# EAGLE schematic MCU board v1.2 (EAGLE 9.1.3)
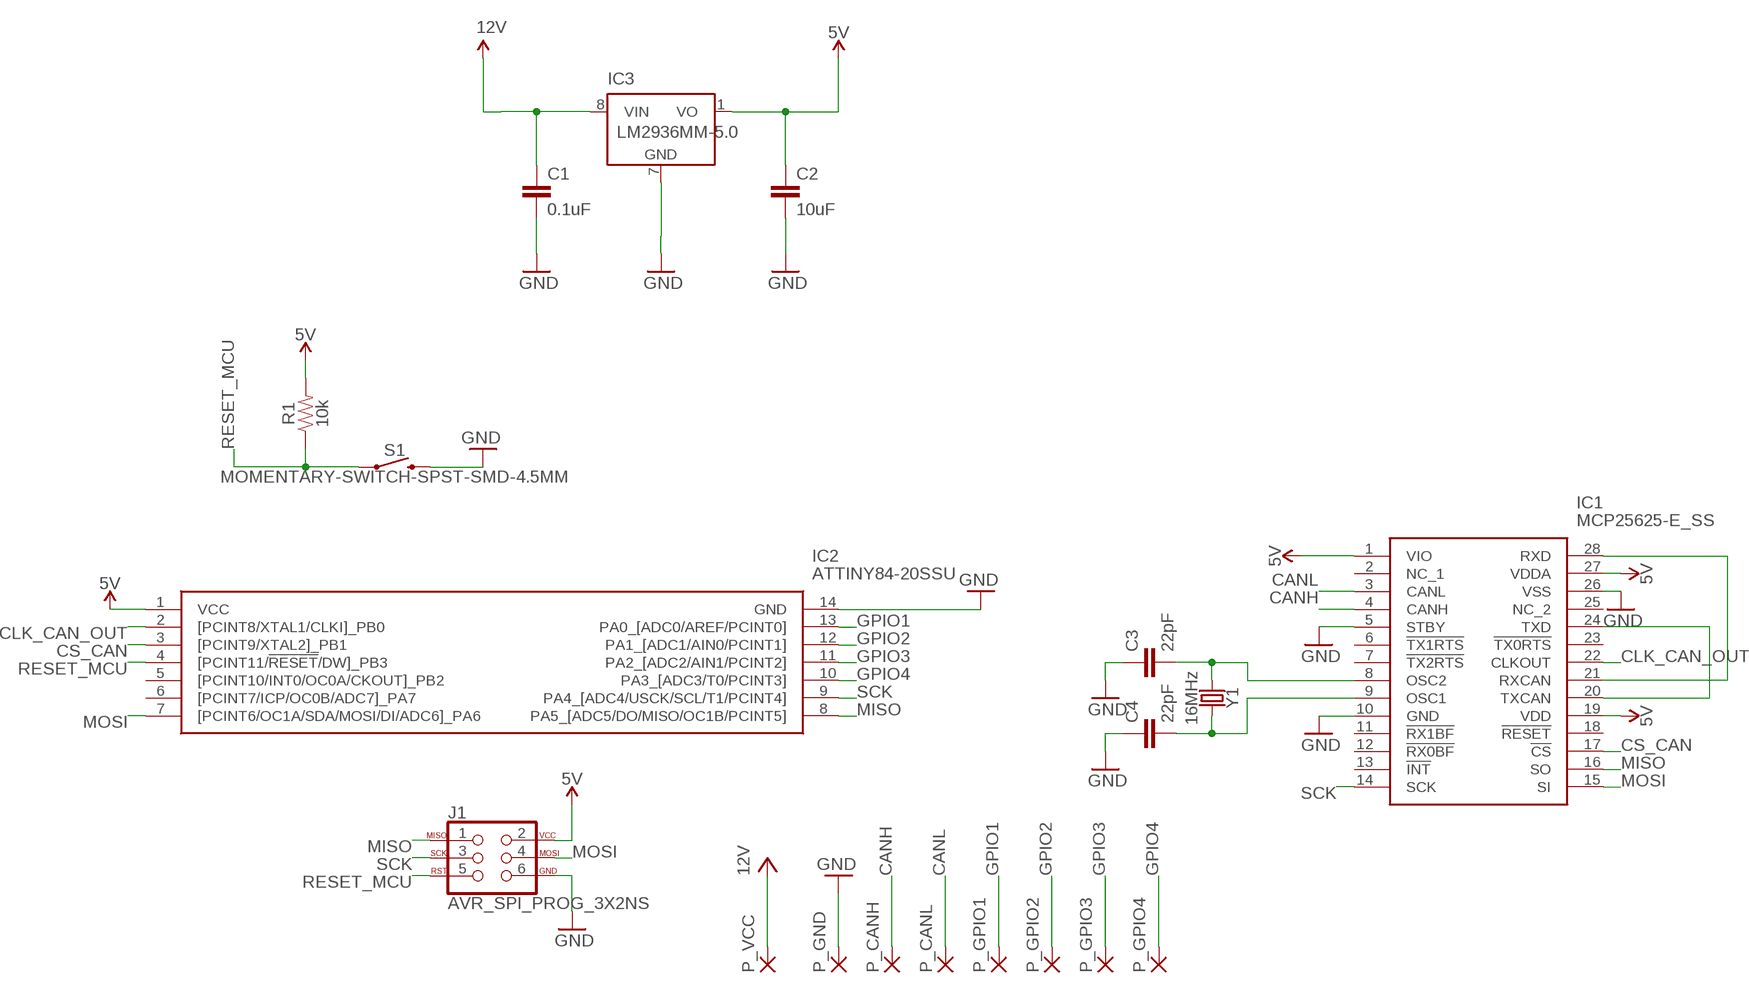
[diagram p0: schematic, sheet 1]

## Parts
C1  0.1uF  0.1UF-0402-16V-10%  [0402]
C2  10uF  10UF-0603-6.3V-20%  [0603]
C3  22pF  22PF-0603-50V-5%  [0603]
C4  22pF  22PF-0603-50V-5%  [0603]
IC1  MCP25625-E_SS  [SOP65P780X200-28N]
IC2  ATTINY84-20SSU  [SOIC127P600X175-14N]
IC3  LM2936MM-5.0  [MINI-SO8]
J1  AVR_SPI_PROG_3X2NS  [2X3-NS]
P_CANH  2,15/1,0  [2,15/1,0]
P_CANL  2,15/1,0  [2,15/1,0]
P_GND  2,15/1,0  [2,15/1,0]
P_GPIO1  2,15/1,0  [2,15/1,0]
P_GPIO2  2,15/1,0  [2,15/1,0]
P_GPIO3  2,15/1,0  [2,15/1,0]
P_GPIO4  2,15/1,0  [2,15/1,0]
P_VCC  2,15/1,0  [2,15/1,0]
R1  10k  10KOHM-0603-1/10W-1%  [0603]
S1  MOMENTARY-SWITCH-SPST-SMD-4.5MM  [TACTILE_SWITCH_SMD_4.5MM]
Y1  16MHz  CRYSTAL-16MHZSMD-5X3.2  [CRYSTAL-SMD-5X3.2-4PAD]

## Nets
5V: C2.1 IC1.1(VIO) IC1.19(VDD) IC1.27(VDDA) IC2.1(VCC) IC3.1(VO) J1.2 R1.2
12V: C1.1 IC3.8(VIN)
CANH: IC1.4(CANH) P_CANH.1(P)
CANL: IC1.3(CANL) P_CANL.1(P)
CLK_CAN_OUT: IC1.22(CLKOUT) IC2.2([PCINT8/XTAL1/CLKI]_PB0)
CS_CAN: IC1.17(!CS) IC2.3([PCINT9/XTAL2]_PB1)
GND: C1.2 C2.2 C3.1 C4.1 IC1.5(STBY) IC1.10(GND) IC1.26(VSS) IC2.14(GND) IC3.7(GND) J1.6 P_GND.1(P) S1.1 S1.4
GPIO1: IC2.13(PA0_[ADC0/AREF/PCINT0]) P_GPIO1.1(P)
GPIO2: IC2.12(PA1_[ADC1/AIN0/PCINT1]) P_GPIO2.1(P)
GPIO3: IC2.11(PA2_[ADC2/AIN1/PCINT2]) P_GPIO3.1(P)
GPIO4: IC2.10(PA3_[ADC3/T0/PCINT3]) P_GPIO4.1(P)
MISO: IC1.16(SO) IC2.8(PA5_[ADC5/DO/MISO/OC1B/PCINT5]) J1.1
MOSI: IC1.15(SI) IC2.7([PCINT6/OC1A/SDA/MOSI/DI/ADC6]_PA6) J1.4
N$1: C4.2 IC1.9(OSC1) Y1.3
N$2: C3.2 IC1.8(OSC2) Y1.1
N$3: IC1.21(RXCAN) IC1.28(RXD)
N$4: IC1.20(TXCAN) IC1.24(TXD)
RESET_MCU: IC2.4([PCINT11/!RESET!/DW]_PB3) J1.5 R1.1 S1.2 S1.3
SCK: IC1.14(SCK) IC2.9(PA4_[ADC4/USCK/SCL/T1/PCINT4]) J1.3
VCC: P_VCC.1(P) ; supply symbol labelled 12V
Unconnected: IC1.2(NC_1) IC1.6(!TX1RTS) IC1.7(!TX2RTS) IC1.11(!RX1BF) IC1.12(!RX0BF) IC1.13(!INT) IC1.18(!RESET) IC1.23(!TX0RTS) IC1.25(NC_2) IC2.5([PCINT10/INT0/OC0A/CKOUT]_PB2) IC2.6([PCINT7/ICP/OC0B/ADC7]_PA7)

## Library data of the parts
C1 = SparkFun-Capacitors:0.1UF: 0.1µF ceramic capacitors A capacitor is a passive two-terminal electrical component used to store electrical energy temporarily in an electric field.; PROD_ID: CAP-12416
C2 = SparkFun-Capacitors:10UF: 10.0µF ceramic capacitors A capacitor is a passive two-terminal electrical component used to store electrical energy temporarily in an electric field.; PROD_ID: CAP-11015
C3 C4 = SparkFun-Capacitors:22PF: 22pF ceramic capacitors A capacitor is a passive two-terminal electrical component used to store electrical energy temporarily in an electric field.; PROD_ID: CAP-07876
IC1 = MCP25625-E_SS:MCP25625-E_SS: CAN Controller with Transceiver SSOP28 Microchip MCP25625-E/SS, CAN Controller 1MBps CAN 2.0, 28-Pin SSOP Source: Datasheet <http://ww1.microchip.com/downloads/en/DeviceDoc/20005282B.pdf>; ALLIED_NUMBER: 70415903; ALLIED_PRICE-STOCK: https://www.alliedelec.com/microchip-technology-inc-mcp25625-e-ss/70415903/; ARROW_PART_NUMBER: MCP25625-E/SS; ARROW_PRICE-STOCK: https://www.arrow.com/en/products/mcp25625-ess/microchip-technology; DESCRIPTION: CAN Controller with Transceiver SSOP28 Microchip MCP25625-E/SS, CAN Controller 1MBps CAN 2.0, 28-Pin SSOP; HEIGHT: 2mm; MANUFACTURER_NAME: Microchip; MANUFACTURER_PART_NUMBER: MCP25625-E/SS; RS_PART_NUMBER: 1651935; RS_PRICE-STOCK: http://uk.rs-online.com/web/p/products/1651935
IC2 = ATTINY84-20SSU:ATTINY84-20SSU: ATTINY84-20SSU, 8 bit AVR Microcontroller 20MHz 8kb Flash, 512B RAM, I2C SPI 14-Pin SOIC Source: Datasheet <http://docs-europe.electrocomponents.com/webdocs/0d68/0900766b80d68843.pdf>; ARROW_PART_NUMBER: ATTINY84-20SSU; ARROW_PRICE-STOCK: https://www.arrow.com/en/products/attiny84-20ssu/microchip-technology; DESCRIPTION: ATTINY84-20SSU, 8 bit AVR Microcontroller 20MHz 8kb Flash, 512B RAM, I2C SPI 14-Pin SOIC; HEIGHT: 1.75mm; MANUFACTURER_NAME: Microchip; MANUFACTURER_PART_NUMBER: ATTINY84-20SSU; RS_PART_NUMBER: 9214633; RS_PRICE-STOCK: http://uk.rs-online.com/web/p/products/9214633
IC3 = national-semiconductor:LM2936?*: Ultra-Low Quiescent Current LDO Voltage Regulator Source: Data sheet <http://www.national.com/ds/LM/LM2936.pdf>; MF: NATIONAL SEMICONDUCTOR; MPN: LM2936MM-5.0/NOPB; OC_FARNELL: 1312707; OC_NEWARK: 41K4518
J1 = SparkFun-Connectors:AVR_SPI_PROG_3X2: AVR ISP 6 Pin This is the reduced ISP connector for AVR programming. Common on Arduino. This footprint will take up less PCB space and can be used with a 10-pin to 6-pin adapter such as SKU: BOB-08508 **Special note about "TEST_POINT" package. The stop mask is on the top side, so if you want your programming test points to be on the bottom of your board, make sure to place this package on the bottom side of the board. This also ensure that the orientation to program from the bottom side will be correct. SparkFun Products: SparkFun ISP Pogo Adapter <https://www.sparkfun.com/products/11591> - NS Tiny AVR Programmer <https://www.sparkfun.com/products/11801> -PTH
P_CANH P_CANL P_GND P_GPIO1-P_GPIO4 P_VCC = wirepad:2,15/1,0: THROUGH-HOLE PAD
R1 = SparkFun-Resistors:10KOHM: 10kΩ resistor A resistor is a passive two-terminal electrical component that implements electrical resistance as a circuit element. Resistors act to reduce current flow, and, at the same time, act to lower voltage levels within circuits. - Wikipedia; PROD_ID: RES-00824
S1 = SparkFun-Switches:MOMENTARY-SWITCH-SPST: Momentary Switch (Pushbutton) - SPST Normally-open (NO) SPST momentary switches (buttons, pushbuttons). Variants PTH-12MM - 12mm square, through-hole Momentary Pushbutton Switch - 12mm Square <https://www.sparkfun.com/products/9190> (COM-09190) PTH-6.0MM, PTH-6.0MM-KIT - 6.0mm square, through-hole Mini Pushbutton Switch <https://www.sparkfun.com/products/97> (COM-00097) KIT package intended for soldering kit's - only one side of pads' copper is exposed. PTH-RIGHT-ANGLE-KIT - Right-angle, through-hole Right Angle Tactile Button <https://www.sparkfun.com/products/10791> - Used on SparkFun BigTime Watch Kit <https://www.sparkfun.com/products/11734> SMD-12MM - 12mm square, surface-mount Tactile Button - SMD (12mm) <https://www.sparkfun.com/products/12993> (COM-12993) Used on SparkFun PicoBoard <https://www.sparkfun.com/products/11888> SMD-4.5MM - 4.5mm Square Trackball Switch Used on SparkFun Blackberry Trackballer Breakout <https://www.sparkfun.com/products/13169> SMD-4.6MMX2.8MM - 4.60mm x 2.80mm, surface mount Used on SparkFun SAMD21 Mini Breakout <https://www.sparkfun.com/products/13664> SMD-5.2MM, SMD-5.2-REDUNDANT - 5.2mm square, surface-mount Mini Pushbutton Switch - SMD <https://www.sparkfun.com/products/8720> (COM-08720) Used on Arduino Pro Mini <https://www.sparkfun.com/products/11114> REDUNDANT package connects both switch circuits together SMD-6.0X3.5MM - 6.0 x 3.5mm, surface mount Momentary Reset Switch SMD <https://www.sparkfun.com/products/8229> (COM-08229) SMD-6.2MM-TALL - 6.2mm square, surface mount Tactile Button - SMD (6mm) <https://www.sparkfun.com/products/12992> Used on SparkFun Digital Sandbox <https://www.sparkfun.com/products/12651> SMD-RIGHT-ANGLE - Right-angle, surface mount Used on SparkFun Block for Intel® Edison - Arduino <https://www.sparkfun.com/products/13036>; PROD_ID: SWCH-09213
Y1 = SparkFun-Clocks:CRYSTAL-16MHZ: 16MHz Crystal Digikey Example <http://www.digikey.com/product-search/en?keywords=535-9122-1-ND> Frequency: 16MHz Frequency Stability: ±50ppm Frequency Tolerance: ±20ppm Load Capacitance: 18pF SparkFun Products: Pro Micro -5V/16MHz <https://www.sparkfun.com/products/12640> SparkFun Serial Enabled LCD Kit <https://www.sparkfun.com/products/10097>; PROD_ID: XTAL-08218; SF_ID: COM-00094